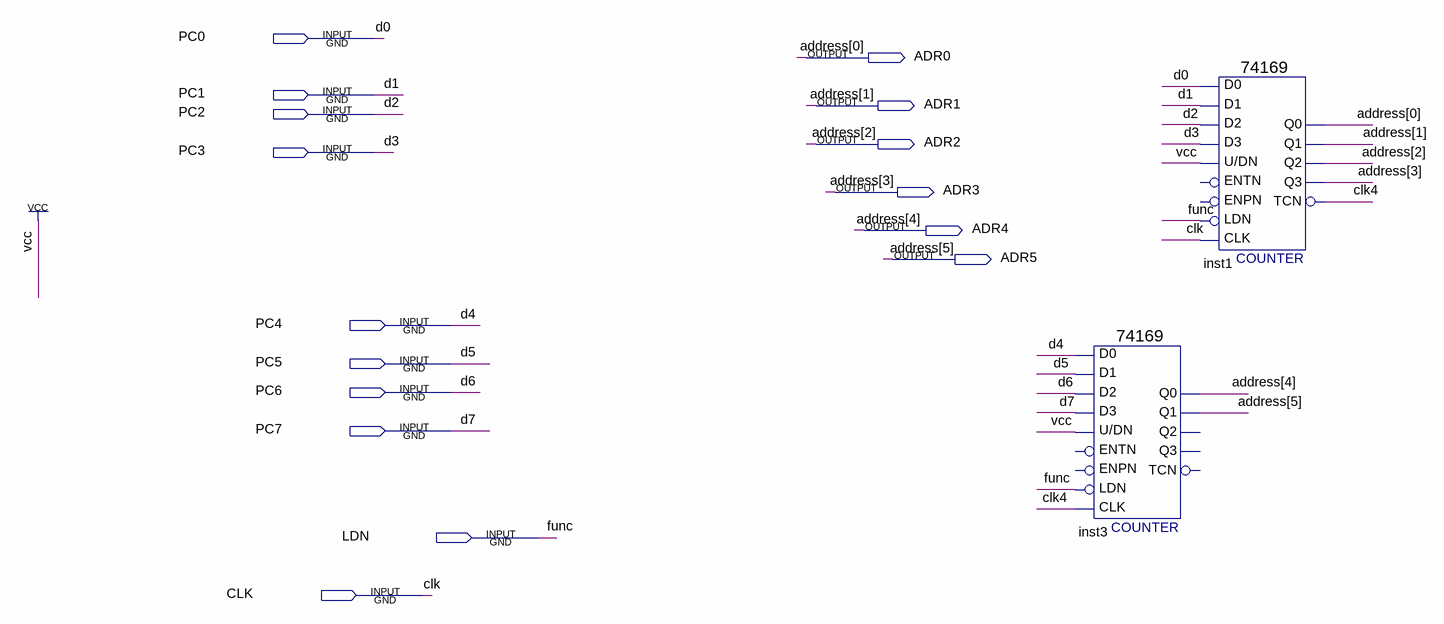
[diagram p0: schematic sheet]
// Quartus schematic PC.bdf as structural Verilog: 2 symbols, 16 pins
module PC (
  input  PC0,
  input  PC1,
  input  PC2,
  input  PC3,
  input  PC4,
  input  PC5,
  input  PC6,
  input  PC7,
  input  LDN,
  input  CLK,
  output ADR0,
  output ADR1,
  output ADR2,
  output ADR3,
  output ADR4,
  output ADR5
);

  wire clk4;

  \74169  inst3 (
    .D1(PC5), .D2(PC6), .D0(PC4), .\U/DN (1'b1), .D3(PC7), .LDN(LDN), .CLK(clk4), .Q1(ADR5), .Q0(ADR4));  // open: ENTN, ENPN, Q2, TCN, Q3
  \74169  inst1 (
    .D1(PC1), .D2(PC2), .D0(PC0), .\U/DN (1'b1), .D3(PC3), .LDN(LDN), .CLK(CLK), .Q2(ADR2), .Q1(ADR1),
    .Q0(ADR0), .TCN(clk4), .Q3(ADR3));  // open: ENTN, ENPN

  // Other names for the same wires on the sheet: address[5:0] = {ADR5, ADR4, ADR3, ADR2, ADR1, ADR0}; d0 = PC0;
  //   d1 = PC1; d2 = PC2; d3 = PC3; d4 = PC4; d5 = PC5; d6 = PC6; d7 = PC7; func = LDN
endmodule
